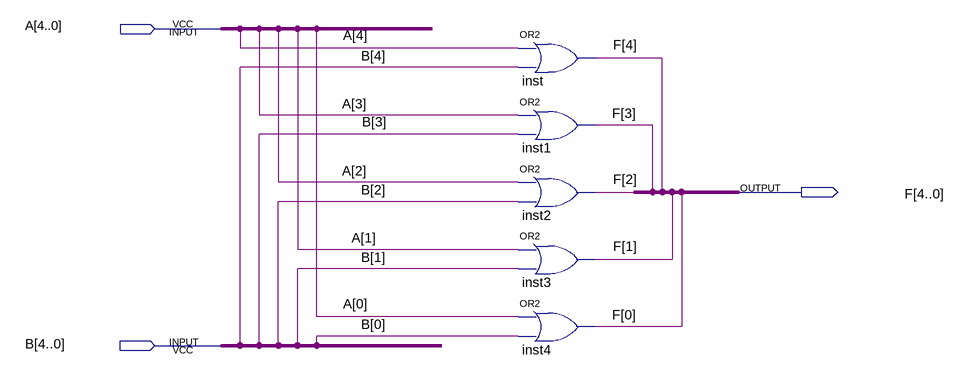
[diagram p0: schematic sheet]
// Quartus schematic For.bdf as structural Verilog: 5 symbols, 3 pins
module For (
  input  [4:0] A,
  input  [4:0] B,
  output [4:0] F
);

  or inst (F[4], A[4], B[4]);
  or inst1 (F[3], A[3], B[3]);
  or inst2 (F[2], A[2], B[2]);
  or inst3 (F[1], A[1], B[1]);
  or inst4 (F[0], A[0], B[0]);
endmodule
